# Altium project FlightBoard.PrjPcb
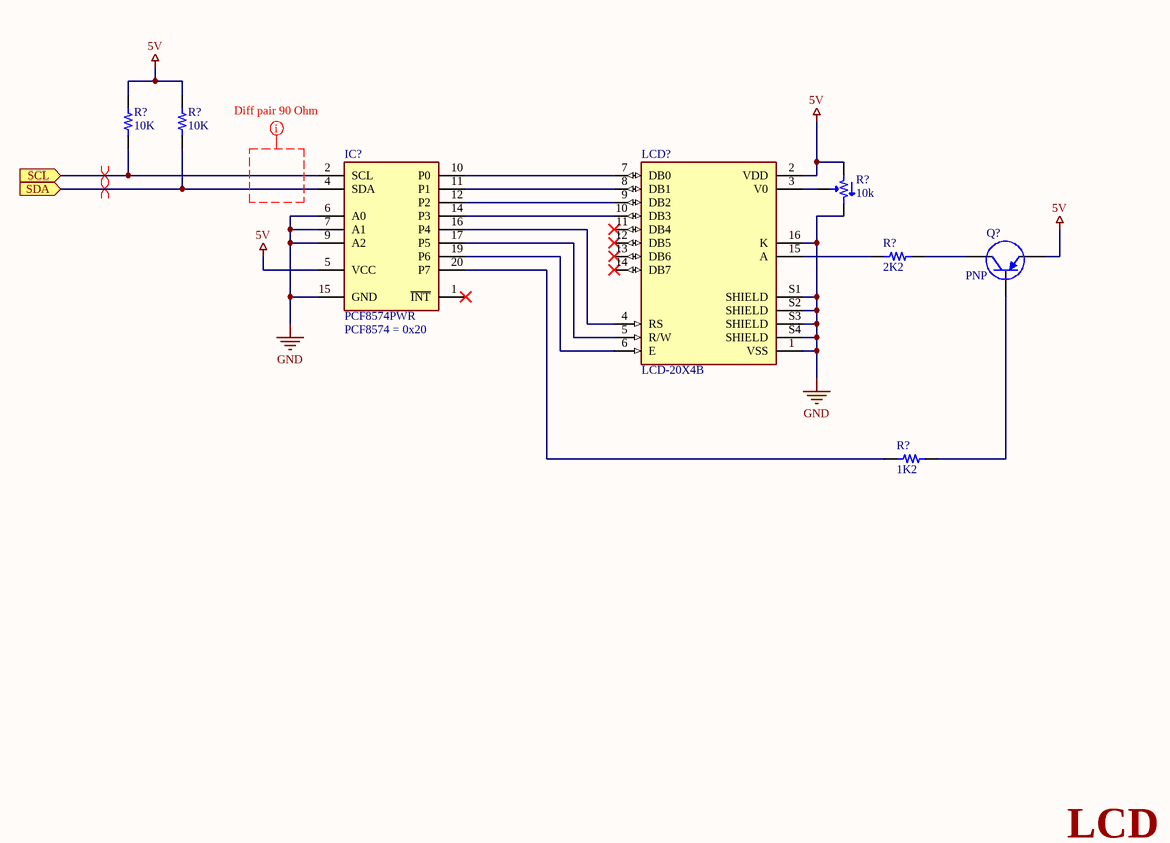
[diagram p0: LCD.SchDoc]
4 sheets, 50 parts. Net scope: flat (ports and power ports of the same name join across sheets).
Board files: PCB_FlightBoard.PcbDoc, Test.PcbDoc
Sheets:
  LCD.SchDoc
  Power.SchDoc
  CPU.SchDoc
  Sensors.SchDoc

## Sheet LCD.SchDoc
size A4; SheetNumber: 1; SheetTotal: 4

### Parts
(Parts that share a designator on the sheet are numbered #1, #2 ... from top to bottom, then left to right.)
IC?  PCF8574PWR  [SOP65P640X120-20N]
LCD?  LCD-20X4B  [LCD_LCD-20X4B]
Q?  PNP  [SOT-23B_N]
R?#1  10K  [RES 0603/1608]
R?#2  10K  [RES 0603/1608]
R?#3  10k  [POT BOURNS TRIMPOT 3302]
R?#4  2K2  [RES 0603/1608]
R?#5  1K2  [RES 0603/1608]

### Ports
SCL (in), SDA (in)

### Nets
5V: IC?.5(VCC) LCD?.2(VDD) Q?.3(E) R?#1.2 R?#2.2 R?#3.1
GND: IC?.6(A0) IC?.7(A1) IC?.9(A2) IC?.15(GND) LCD?.1(VSS) LCD?.16(K) LCD?.S1(SHIELD) LCD?.S2(SHIELD) LCD?.S3(SHIELD) LCD?.S4(SHIELD) R?#3.3
NetIC?_2: IC?.2(SCL) R?#1.1 ; port SCL
NetIC?_4: IC?.4(SDA) R?#2.1 ; port SDA
NetIC?_10: IC?.10(P0) LCD?.7(DB0)
NetIC?_11: IC?.11(P1) LCD?.8(DB1)
NetIC?_12: IC?.12(P2) LCD?.9(DB2)
NetIC?_14: IC?.14(P3) LCD?.10(DB3)
NetIC?_16: IC?.16(P4) LCD?.4(RS)
NetIC?_17: IC?.17(P5) LCD?.5(R/W)
NetIC?_19: IC?.19(P6) LCD?.6(E)
NetIC?_20: IC?.20(P7) R?#5.1
NetLCD?_3: LCD?.3(V0) R?#3.2
NetLCD?_15: LCD?.15(A) R?#4.1
NetQ?_1: Q?.1(C) R?#4.2
NetQ?_2: Q?.2(B) R?#5.2

Not connected (* = marked no-connect by the designer): IC? 1(~{INT})*; LCD? 11(DB4)* 12(DB5)* 13(DB6)* 14(DB7)*

### Layout directives
differential pair: NetIC?_2, NetIC?_4
mark named Diff pair 90 Ohm: (no net found under the mark)

### Notes on the sheet
- (near IC?) PCF8574 = 0x20
- LCD

### Library data of the parts
IC? = PCF8574PWR: Integrated Circuit; Manufacturer_Name: Texas Instruments; Datasheet Link: http://www.ti.com/lit/ds/symlink/pcf8574.pdf; Height: 1.2mm; Manufacturer_Part_Number: PCF8574PWR; Mouser Part Number: 595-PCF8574PWR; Mouser Price/Stock: https://www.mouser.co.uk/ProductDetail/Texas-Instruments/PCF8574PWR?qs=X1HXWTtiZ0T3gnyuO%2Fq4CA%3D%3D; Arrow Part Number: PCF8574PWR; Arrow Price/Stock: https://www.arrow.com/en/products/pcf8574pwr/texas-instruments?region=nac
LCD? = LCD-20X4B: Display Development Tools 20X4 CHARACTER BLUE LCD W/BACKLIGHT; Value: *; Availability: Unavailable; Price: None; Package: None; MP: LCD-20X4B
Q? = BC327-25: PNP Bipolar Transistor; Published: 8-Jun-2000; LatestRevisionDate: 29-May-2009; LatestRevisionNote: IPC-7351 Footprint Added.; PackageVersion: Aug-1999; PackageReference: SOT-23B; Publisher: Altium Limited; PackageDescription: 3-Pin SOT-23 Package 0.95 mm Pitch, 2.4 mm Lead Span
R?#1 R?#2 = 0603S8J0103: RES SMD 10K OHM 5% 1/8W 0603; Manufacturer: Uniohm; TemperatureRange: -55C ~ 155C; TemperatureCoefficient: 100ppm/C; PowerRating: 0.125W, 1/8W; Value: 10K; Part Number: 0603S8J0103; Tolerance: 5%; Price: 0.0089; Device Package: 1608 (0603 Metric)
R?#3 = 3302W-3-103E: TRIMMER 10K OHM 0.15W SMD; Manufacturer: Bourns Inc.; TemperatureCoefficient: 250ppm/C; Tolerance: 25%; Number Of Turns: 1; Adjustment Type: Top Adjustment; Value: 10k; Part Number: 3302W-3-103E; PartId: 29445; Supplier 1: Digi-Key; Supplier Part Number 1: 3302W-103ECT-ND; ComponentLink1Description: Datasheet; ComponentLink1URL: http://www.bourns.com/docs/Product-Datasheets/3302.pdf; ComponentLink2Description: Digi-Key Listing; ComponentLink2URL: https://www.digikey.com/product-detail/en/bourns-inc/3302W-3-103E/3302W-103ECT-ND/612876; PowerRating: 0.15W; Price: 0.97
R?#4 = 0603S8J0222: RES SMD 2K2 OHM 5% 1/8W 0603; Manufacturer: Uniohm; TemperatureRange: -55C ~ 155C; TemperatureCoefficient: 100ppm/C; PowerRating: 0.125W, 1/8W; Value: 2K2; Part Number: 0603S8J0222; Tolerance: 5%; Price: 0.0089; Device Package: 1608 (0603 Metric)
R?#5 = 0603S8J0122: RES SMD 1K2 OHM 5% 1/8W 0603; Manufacturer: Uniohm; TemperatureRange: -55C ~ 155C; TemperatureCoefficient: 100ppm/C; PowerRating: 0.125W, 1/8W; Value: 1K2; Part Number: 0603S8J0122; Tolerance: 5%; Price: 0.0089; Device Package: 1608 (0603 Metric)

## Sheet Power.SchDoc
size A4; SheetNumber: 4; SheetTotal: 4
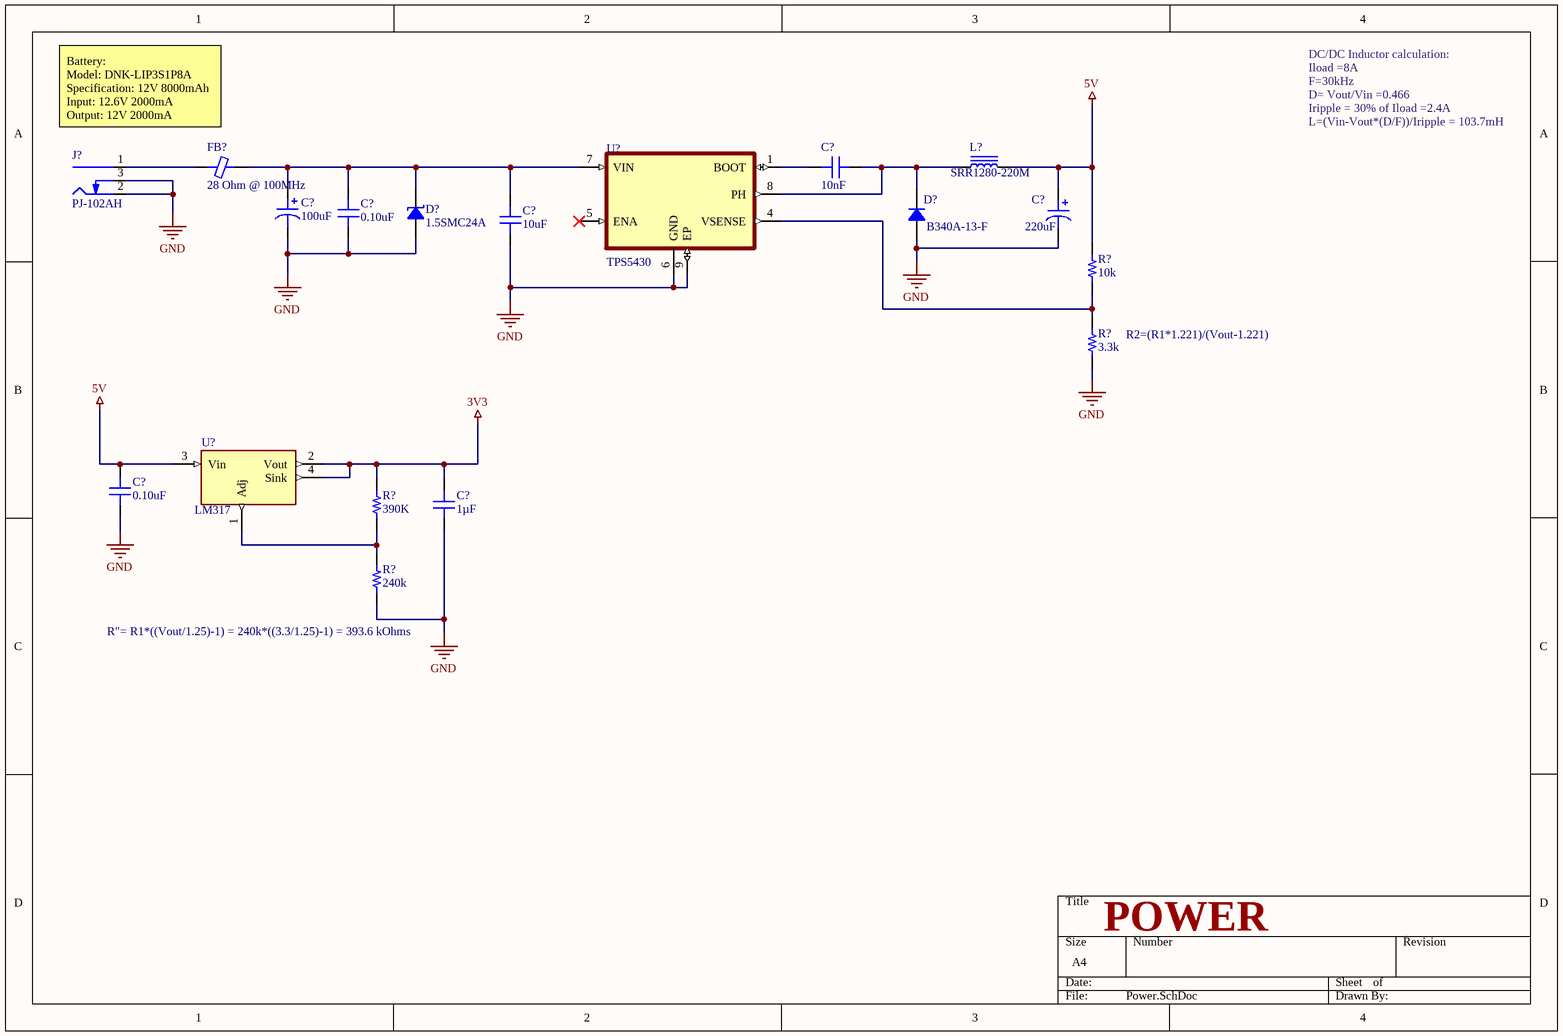
[diagram p1: Power.SchDoc]

### Parts
(Parts that share a designator on the sheet are numbered #1, #2 ... from top to bottom, then left to right.)
C?#1  10nF  [CAP 0805/2012]
C?#2  100uF  [CAP ALUM 10.3MM]
C?#3  0.10uF  [CAP 0603/1608]
C?#4  220uF  [CAP ALUM 10.3MM]
C?#5  10uF  [CAP 1210/3225 - 2.8MM]
C?#6  0.10uF  [CAP 0603/1608]
C?#7  1µF  [CAP 0805_2012]
D?#1  1.5SMC24A  [DO214AB SMC]
D?#2  B340A-13-F  [DO214AC SMA]
FB?#1  28 Ohm @ 100MHz  [FER 0603/1608]
J?  PJ-102AH  [CUI PJ-102AH]
L?  SRR1280-220M  [BOURNS SRR1280]
R?#6  10k  [RES 0603/1608]
R?#7  3.3k  [RES 0603/1608]
R?#8  390K  [RES 0603/1608]
R?#9  240k  [RES 0603/1608]
U?#1  TPS5430  [VREG_LM5017MR/NOPB]
U?#2  LM317  [TI SOT-223 DCY]

### Nets
3V3: C?#7.2 R?#8.2 U?#2.2(Vout) U?#2.4(Sink)
5V: C?#4.1 C?#6.2 L?.2 R?#6.2 U?#2.3(Vin)
GND: C?#2.2 C?#3.1 C?#4.2 C?#5.2 C?#6.1 C?#7.1 D?#1.1 D?#2.1 J?.2(Outer) J?.3(SW) R?#7.1 R?#9.1 U?#1.6(GND) U?#1.9(EP)
NetC?#1_1: C?#1.1 U?#1.1(BOOT)
NetC?#1_2: C?#1.2 D?#2.2 L?.1 U?#1.8(PH)
NetC?#2_1: C?#2.1 C?#3.2 C?#5.1 D?#1.2 FB?#1.2 U?#1.7(VIN)
NetFB?#1_1: FB?#1.1 J?.1(Centre)
NetR?#6_1: R?#6.1 R?#7.2 U?#1.4(VSENSE)
NetR?#8_1: R?#8.1 R?#9.2 U?#2.1(Adj)

Not connected (* = marked no-connect by the designer): U?#1 5(ENA)*

### Notes on the sheet
- Battery:
  Model: DNK-LIP3S1P8A
  Specification: 12V 8000mAh
  Input: 12.6V 2000mA
  Output: 12V 2000mA
- DC/DC Inductor calculation:
  Iload =8A
  F=30kHz
  D= Vout/Vin =0.466
  Iripple = 30% of Iload =2.4A
  L=(Vin-Vout*(D/F))/Iripple = 103.7mH
- (near R?#7) R2=(R1*1.221)/(Vout-1.221)
- (near R?#9) R"= R1*((Vout/1.25)-1) = 240k*((3.3/1.25)-1) = 393.6 kOhms
- POWER

### Library data of the parts
C?#1 = C0805C103K5RACAUTO: CAP CER 10000PF 50V X7R 0805; Manufacturer: Kemet; TemperatureRange: -55C ~ 125C; Tolerance: 10%; Value: 10nF; Part Number: C0805C103K5RACAUTO; PartId: 14086; Supplier 1: Digi-Key; Supplier Part Number 1: 399-6924-2-ND; ComponentLink1Description: Datasheet; ComponentLink1URL: http://www.kemet.com/docfinder?Partnumber=C0805C103K5RACAUTO; ComponentLink2Description: Digi-Key Listing; ComponentLink2URL: https://www.digikey.com/product-detail/en/kemet/C0805C103K5RACAUTO/399-6924-2-ND/3314918; TemperatureCoefficient: X7R; Voltage: 50V; Price: 0.0167; Device Package: 0805 (2012 Metric)
C?#2 = EEE-1HA101P: CAP ALUM 100UF 20% 50V SMD; Manufacturer: Panasonic Electronic Components; TemperatureRange: -40C ~ 85C; Type: Automotive; Ripple Current: 250mA; Lifetime @ Temp: 2000 Hrs @ 85C; Value: 100uF; Part Number: EEE-1HA101P; PartId: 7398; Supplier 1: Digi-Key; Supplier Part Number 1: PCE3916TR-ND; ComponentLink1Description: Datasheet; ComponentLink1URL: http://media.digikey.com/pdf/Data%20Sheets/Panasonic%20Electronic%20Components/S_Series_Type_V.pdf; ComponentLink2Description: Digi-Key listing; ComponentLink2URL: http://digikey.com/product-detail/en/EEE-1HA101P/PCE3916TR-ND/766083; Tolerance: 20%; Voltage: 50V; Price: 0.3144; Device Package: Radial, Can - SMD; Impedance: -
C?#3 C?#6 = C0603C104J3RACTU: CAP CER 0.1UF 25V X7R 0603; Manufacturer: Kemet; TemperatureRange: -55C ~ 125C; Tolerance: 5%; Value: 0.10uF; Part Number: C0603C104J3RACTU; PartId: 13224; Supplier 1: Digi-Key; Supplier Part Number 1: 399-1282-2-ND; ComponentLink1Description: Datasheet; ComponentLink1URL: http://www.kemet.com/docfinder?Partnumber=C0603C104J3RACTU; ComponentLink2Description: Digi-Key Listing; ComponentLink2URL: https://www.digikey.com/product-detail/en/kemet/C0603C104J3RACTU/399-1282-2-ND/416045; TemperatureCoefficient: X7R; Voltage: 25V; Price: 0.0714; Device Package: 0603 (1608 Metric)
C?#4 = 875075561008: CAP POLYMER 220UF 20% 25V SMD; Manufacturer: Wurth Electronics Inc; TemperatureRange: -55C ~ 105C; Type: General Purpose; Ripple Current: 4.8A; Lifetime @ Temp: 2000 Hrs @ 105C; Value: 220uF; Part Number: 875075561008; PartId: 7727; Supplier 1: Digi-Key; Supplier Part Number 1: 732-6502-2-ND; ComponentLink1Description: Datasheet; ComponentLink1URL: http://katalog.we-online.de/pbs/datasheet/875075561008.pdf; ComponentLink2Description: Digi-Key listing; ComponentLink2URL: http://digikey.com/product-detail/en/875075561008/732-6502-2-ND/5147666; Tolerance: 20%; Voltage: 25V; Price: 1.8044; Device Package: Radial, Can - SMD; Impedance: -
C?#5 = 12105C106KAT2A: CAP CER 10UF 50V X7R 1210; Manufacturer: AVX Corporation; TemperatureRange: -55C ~ 125C; Tolerance: 10%; Value: 10uF; Part Number: 12105C106KAT2A; PartId: 19201; Supplier 1: Digi-Key; Supplier Part Number 1: 478-9912-2-ND; ComponentLink1Description: Datasheet; ComponentLink1URL: http://datasheets.avx.com/X7RDielectric.pdf; ComponentLink2Description: Digi-Key Listing; ComponentLink2URL: https://www.digikey.com/product-detail/en/avx-corporation/12105C106KAT2A/478-9912-2-ND/6006191; TemperatureCoefficient: X7R; Voltage: 50V; Price: 0.2813; Device Package: 1210 (3225 Metric)
C?#7 = CL21A105KBCLNNC: CAP CER 1UF 50V X5R 0805; Manufacturer: Samsung Electro-Mechanics; Tolerance: ±10%; Part Number: CL21A105KBCLNNC; Value: 1µF; Applications: General Purpose; Capacitance: 1µF; ComponentLink1Description: Datasheet; ComponentLink1URL: http://www.samsungsem.com/kr/support/product-search/mlcc/CL21A105KBCLNNC.jsp; ComponentLink2Description: DigiKey Link; ComponentLink2URL: http://digikey.com/product-detail/en/samsung-electro-mechanics/CL21A105KBCLNNC/1276-2396-1-ND/3890482; Device Package: 0805 (2012 Metric); Features: Low Profile; LastUpdated: 9/2/2020 1:04:16 AM; Lifecycle Status: Active; Minimum Order: 1; Mounting Type: Surface Mount, MLCC; Operating Temperature: -55°C ~ 85°C; Package / Case: 0805 (2012 Metric); Packaging: TapeAndReel; PartId: 15373; Part Status: Active; Price: 0.03; Series: CL; Size / Dimension: 0.079" L x 0.049" W (2.00mm x 1.25mm); Supplier 1: DigiKey; Supplier Part Number 1: 1276-2396-1-ND; Temperature Coefficient: X5R; Thickness (Max): 0.037" (0.95mm); Voltage - Rated: 50V
D?#1 = 1.5SMC24A: TVS DIODE 20.5V 33.2V DO214AB; Manufacturer: Littelfuse Inc.; Current - Peak Pulse (10/1000µs): 45.8A; Power Line Protection: No; Power - Peak Pulse: 1500W (1.5kW); Type: Zener; Unidirectional Channels: 1; Voltage - Breakdown (Min): 22.8V; Part Number: 1.5SMC24A; Applications: General Purpose; ComponentLink1Description: Datasheet; ComponentLink1URL: https://www.littelfuse.com/~/media/electronics/datasheets/tvs_diodes/littelfuse_tvs_diode_1_5smc_datasheet.pdf.pdf; ComponentLink2Description: DigiKey Link; ComponentLink2URL: http://digikey.com/product-detail/en/littelfuse-inc/1.5SMC24A/1.5SMC24ACT-ND/1835386; LastUpdated: 9/2/2020 1:20:00 AM; Lifecycle Status: Active; Minimum Order: 1; Mounting Type: Surface Mount; Operating Temperature: -55°C ~ 150°C (TJ); Package / Case: DO-214AB, SMC; Packaging: TapeAndReel; PartId: 6399; Part Status: Active; Price: 0.18; Series: 1.5SMC; Supplier 1: DigiKey; Supplier Part Number 1: 1.5SMC24ACT-ND; Supplier Device Package: DO-214AB (SMCJ); Voltage - Clamping (Max) @ Ipp: 33.2V; Voltage - Reverse Standoff (Typ): 20.5V
D?#2 = B340A-13-F: DIODE SCHOTTKY 40V 3A SMA; Manufacturer: Diodes Incorporated; Current Reverse Leakage @ Vr: 500uA @ 40V; Voltage Forward (Vf): 500mV @ 3A; Part Number: B340A-13-F; PartId: 16333; Supplier 1: Digi-Key; Supplier Part Number 1: B340A-FDITR-ND; ComponentLink1Description: Datasheet; ComponentLink1URL: http://www.diodes.com/_files/datasheets/ds30891.pdf; ComponentLink2Description: Digi-Key Listing; ComponentLink2URL: https://www.digikey.com/product-detail/en/diodes-incorporated/B340A-13-F/B340A-FDITR-ND/725015; Junction Operating Temperature: -55C ~ 150C; Price: 0.1085; Type: Schottky; Device Package: DO-214AC, SMA; Voltage DC Reverse (Vr): 40V; Current Rectified: 3A
FB?#1 = 742792603: FERRITE CHIP 28 OHM 4.0A 0603; Manufacturer: Wurth Electronics Inc; Type: Differential Mode - Single; DC Resistance: 30 mOhm Max; Current Rating: 4A; Part Number: 742792603; PartId: 6745; Value: 28 Ohm @ 100MHz; Supplier 1: Digi-Key; Supplier Part Number 1: 732-1590-2-ND; ComponentLink1Description: Datasheet; ComponentLink1URL: http://katalog.we-online.de/pbs/datasheet/742792603.pdf; ComponentLink2Description: Digi-Key listing; ComponentLink2URL: http://digikey.com/product-detail/en/742792603/732-1590-2-ND/1638994; Price: 0.1829; Device Package: 0603 (1608 Metric)
J? = PJ-102AH: CONN PWR JACK 2X5.5MM SOLDER; Manufacturer: CUI Devices; Actual Diameter: 0.079" (2.00mm ID), 0.256" (6.50mm OD); Current Rating (Amps): 5A; Gender: Male; Industry Recognized Mating Diameter: 2.00mm ID (0.079"), 5.50mm OD (0.217"); Internal Switch(s): Single Switch, Normally Closed; Material Flammability Rating: UL94 V-0; Mating Length/Depth: 0.354" (9.00mm); Number of Positions/Contacts: 2 Conductors, 3 Contacts; Shielding: Unshielded; Voltage - Rated: 24VDC; Part Number: PJ-102AH; ComponentLink1Description: Datasheet; ComponentLink1URL: https://www.cuidevices.com/product/resource/digikeypdf/pj-102ah.pdf; ComponentLink2Description: DigiKey Link; ComponentLink2URL: //digikey.com/product-detail/en/cui-devices/PJ-102AH/CP-102AH-ND/408448; Connector Type: Jack; LastUpdated: 12/16/2019 7:01:27 PM; Lifecycle Status: 0; Minimum Order: 1; Mounting Type: Through Hole, Right Angle; Packaging: Tray; Part Status: Active; Price: 0.76; Series: -; Supplier 1: DigiKey; Supplier Part Number 1: CP-102AH-ND; Termination: Solder
L? = SRR1280-220M: FIXED IND 22UH 4.3A 38.6 MOHM; Manufacturer: Bourns Inc.; Type: Wirewound; Material - Core: Ferrite; Tolerance: 20%; Current - Saturation: 4.1A; Shielding: Shielded; DC Resistance (DCR): 38.6 mOhm Max; Q @ Freq: 20 @ 2.52MHz; Frequency - Self Resonant: 11MHz; Value: 22uH; Part Number: SRR1280-220M; PartId: 15714; Supplier 1: Digi-Key; Supplier Part Number 1: SRR1280-220MTR-ND; ComponentLink1Description: Datasheet; ComponentLink1URL: http://www.bourns.com/docs/Product-Datasheets/SRR1280.pdf; ComponentLink2Description: Digi-Key Listing; ComponentLink2URL: https://www.digikey.com/product-detail/en/bourns-inc/SRR1280-220M/SRR1280-220MTR-ND/1969996; Price: 0.7737; Device Package: Nonstandard; Series: SRR1280; Inductance: 22uH; Current Rating: 4.3A; Operating Temperature: -40C ~ 125C
R?#6 = ERA-3AEB103V: RES SMD 10K OHM 0.1% 1/10W 0603; Manufacturer: Panasonic Electronic Components; TemperatureRange: -55C ~ 155C; TemperatureCoefficient: 25ppm/C; PowerRating: 0.1W, 1/10W; Value: 10k; Part Number: ERA-3AEB103V; PartId: 1432; Supplier 1: Digi-Key; Supplier Part Number 1: P10KDBTR-ND; ComponentLink1Description: Datasheet; ComponentLink1URL: http://industrial.panasonic.com/lecs/www-data/pdf/AOA0000/AOA0000CE26.pdf; ComponentLink2Description: Digi-Key listing; ComponentLink2URL: http://digikey.com/product-detail/en/ERA-3AEB103V/P10KDBTR-ND/1465878; Tolerance: 0.1%; Price: 0.055; Type: Thin Film; Device Package: 0603 (1608 Metric)
R?#7 = ERA-3APB332V: RES SMD 3.3K OHM 0.1% 1/10W 0603; Manufacturer: Panasonic Electronic Components; TemperatureRange: -55C ~ 155C; TemperatureCoefficient: 15ppm/C; PowerRating: 0.1W, 1/10W; Value: 3.3k; Part Number: ERA-3APB332V; PartId: 1857; Supplier 1: Digi-Key; Supplier Part Number 1: P3.3KAYTR-ND; ComponentLink1Description: Datasheet; ComponentLink1URL: http://industrial.panasonic.com/lecs/www-data/pdf/AOA0000/AOA0000CE26.pdf; ComponentLink2Description: Digi-Key listing; ComponentLink2URL: http://digikey.com/product-detail/en/ERA-3APB332V/P3.3KAYTR-ND/3070646; Tolerance: 0.1%; Price: 0.2873; Type: Thin Film; Device Package: 0603 (1608 Metric)
R?#8 = 0603S8J0394: RES SMD 390K OHM 5% 1/8W 0603; Manufacturer: Uniohm; TemperatureRange: -55C ~ 155C; TemperatureCoefficient: 100ppm/C; PowerRating: 0.125W, 1/8W; Value: 390K; Part Number: 0603S8J0394; Tolerance: 5%; Price: 0.0089; Device Package: 1608 (0603 Metric)
R?#9 = ERJ-3EKF2403V: RES SMD 240K OHM 1% 1/10W 0603; Manufacturer: Panasonic Electronic Components; TemperatureRange: -55C ~ 155C; TemperatureCoefficient: 100ppm/C; PowerRating: 0.1W, 1/10W; Value: 240k; Part Number: ERJ-3EKF2403V; PartId: 1186; Supplier 1: Digi-Key; Supplier Part Number 1: P240KHTR-ND; ComponentLink1Description: Datasheet; ComponentLink1URL: http://industrial.panasonic.com/www-cgi/jvcr13pz.cgi?E+PZ+3+AOA0002+ERJ3EKF2403V+7+WW; ComponentLink2Description: Digi-Key listing; ComponentLink2URL: http://digikey.com/product-detail/en/ERJ-3EKF2403V/P240KHTR-ND/1746349; Tolerance: 1%; Price: 0.0038; Type: Thick Film; Device Package: 0603 (1608 Metric)
U?#1 = TPS5430DDA: CONVERTER 5.5V-36 to 5.5V; MF: Texas Instruments; Availability: Unavailable; Mouser-Purchase-URL: https://snapeda.com/shop?store=Mouser&id=226174; Texas_Instruments-Purchase-URL: https://snapeda.com/shop?store=Texas+Instruments&id=226174; Package: HSOIC-8 Texas Instruments; Price: None; SnapEDA_Link: https://www.snapeda.com/parts/TPS5430DDA/Texas%20Instruments/view-part/226174/?ref=snap; MP: TPS5430DDA; DigiKey-Purchase-URL: https://snapeda.com/shop?store=DigiKey&id=226174; Value: *
U?#2 = LM317DCVR: Adjustable voltage regulator, 1.5A, output range 1.25 - 37 V

## Sheet CPU.SchDoc
size A4; SheetNumber: 2; SheetTotal: 4
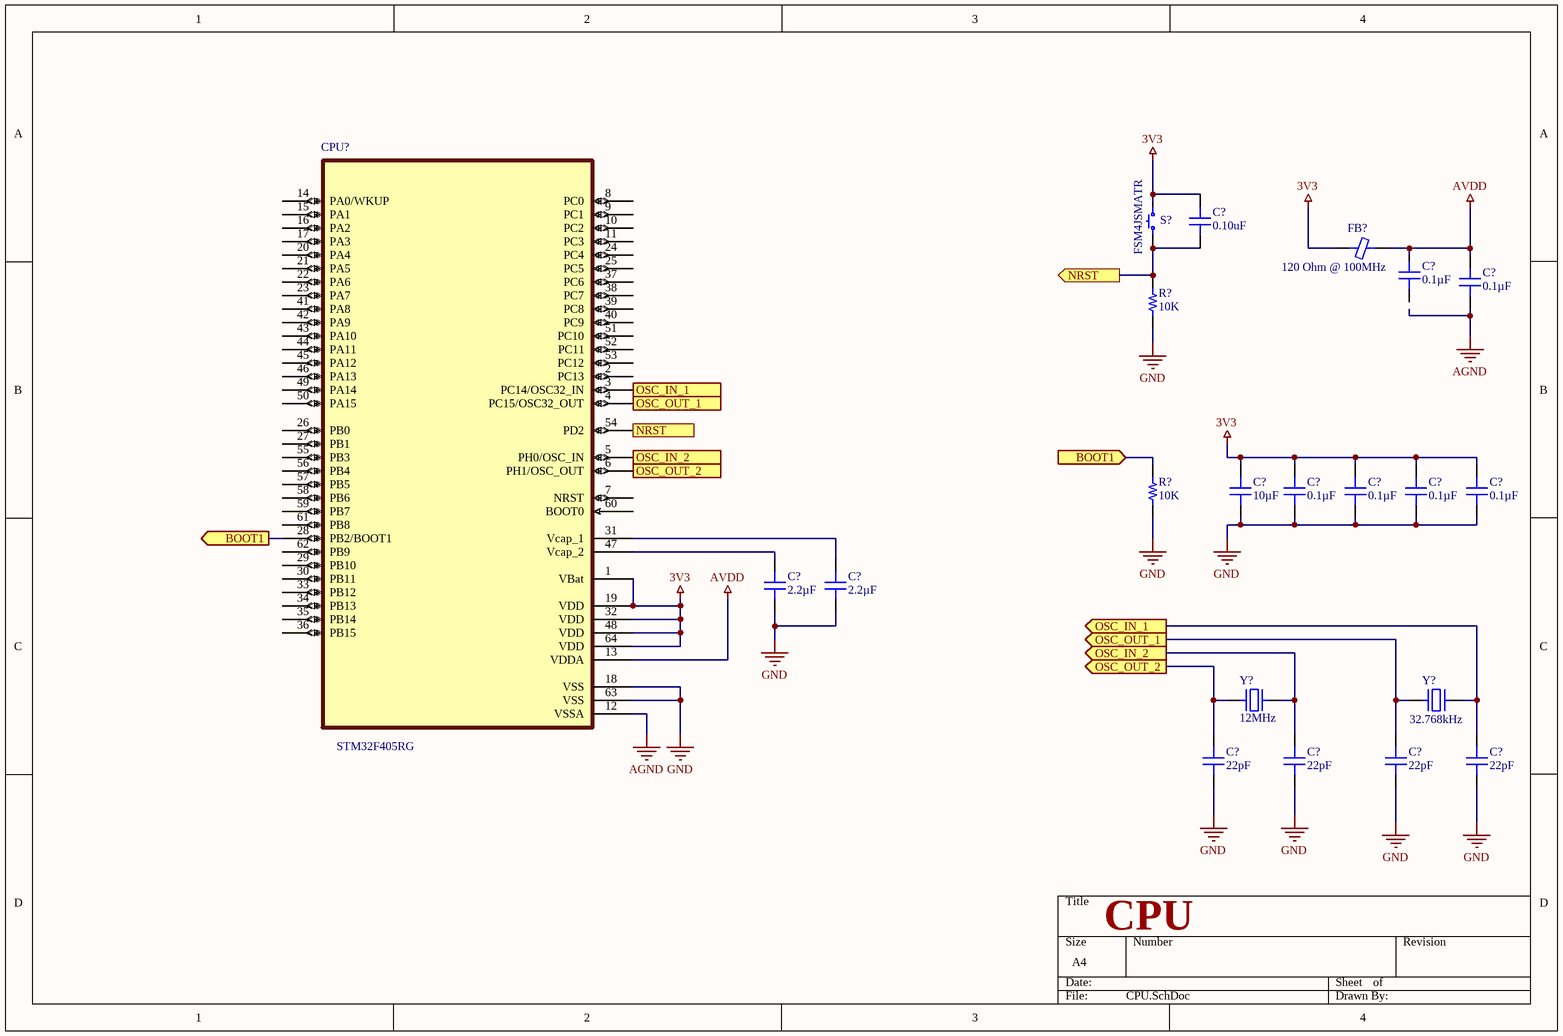
[diagram p2: CPU.SchDoc]

### Parts
(Parts that share a designator on the sheet are numbered #1, #2 ... from top to bottom, then left to right.)
C?#8  0.10uF  [CAP 0603/1608]
C?#9  0.1µF  [CAP 0603_1608]
C?#10  0.1µF  [CAP 0603_1608]
C?#11  10µF  [CAP 0603_1608]
C?#12  0.1µF  [CAP 0603_1608]
C?#13  0.1µF  [CAP 0603_1608]
C?#14  0.1µF  [CAP 0603_1608]
C?#15  0.1µF  [CAP 0603_1608]
C?#16  2.2µF  [CAP 0603_1608]
C?#17  2.2µF  [CAP 0603_1608]
C?#18  22pF  [CAP 0402_1005]
C?#19  22pF  [CAP 0402_1005]
C?#20  22pF  [CAP 0402_1005]
C?#21  22pF  [CAP 0402_1005]
CPU?  STM32F405RG  [LQF64]
FB?#2  120 Ohm @ 100MHz  [FER 0805/2012]
R?#10  10K  [RES 0603/1608]
R?#11  10K  [RES 0603/1608]
S?  FSM4JSMATR  [TE FSM4JSMA]
Y?#1  12MHz  [ECS CSM-3X]
Y?#2  32.768kHz  [ABRACON ABS25]

### Ports
BOOT1 (in), BOOT1 (out), NRST (out), OSC_IN_1 (out), OSC_IN_2 (out), OSC_OUT_1 (out), OSC_OUT_2 (out)

### Nets
3V3: C?#8.2 C?#11.2 C?#12.2 C?#13.2 C?#14.2 C?#15.2 CPU?.1(VBat) CPU?.19(VDD) CPU?.32(VDD) CPU?.48(VDD) CPU?.64(VDD) FB?#2.1 S?.1 S?.2
AGND: C?#10.1 CPU?.12(VSSA)
AVDD: C?#9.2 C?#10.2 CPU?.13(VDDA) FB?#2.2
GND: C?#11.1 C?#12.1 C?#13.1 C?#14.1 C?#15.1 C?#16.1 C?#17.1 C?#18.1 C?#19.2 C?#20.1 C?#21.1 CPU?.18(VSS) CPU?.63(VSS) R?#10.1 R?#11.1
NetC?#8_1: C?#8.1 CPU?.54(PD2) R?#10.2 S?.3 S?.4 ; port NRST
NetC?#16_2: C?#16.2 CPU?.47(Vcap_2)
NetC?#17_2: C?#17.2 CPU?.31(Vcap_1)
NetC?#18_2: C?#18.2 CPU?.6(PH1/OSC_OUT) Y?#1.1 ; port OSC_OUT_2
NetC?#19_1: C?#19.1 CPU?.5(PH0/OSC_IN) Y?#1.2 ; port OSC_IN_2
NetC?#20_2: C?#20.2 CPU?.4(PC15/OSC32_OUT) Y?#2.1 ; port OSC_OUT_1
NetC?#21_2: C?#21.2 CPU?.3(PC14/OSC32_IN) Y?#2.4 ; port OSC_IN_1
NetCPU?_28: CPU?.28(PB2/BOOT1) R?#11.2 ; port BOOT1

Not connected (* = marked no-connect by the designer): C?#9 1; CPU? 2(PC13) 7(NRST) 8(PC0) 9(PC1) 10(PC2) 11(PC3) 14(PA0/WKUP) 15(PA1) 16(PA2) 17(PA3) 20(PA4) 21(PA5) 22(PA6) 23(PA7) 24(PC4) 25(PC5) 26(PB0) 27(PB1) 29(PB10) 30(PB11) 33(PB12) 34(PB13) 35(PB14) 36(PB15) 37(PC6) 38(PC7) 39(PC8) 40(PC9) 41(PA8) 42(PA9) 43(PA10) 44(PA11) 45(PA12) 46(PA13) 49(PA14) 50(PA15) 51(PC10) 52(PC11) 53(PC12) 55(PB3) 56(PB4) 57(PB5) 58(PB6) 59(PB7) 60(BOOT0) 61(PB8) 62(PB9)

### Notes on the sheet
- CPU

### Library data of the parts
C?#8 = CL10B104KB8NNNC: CAP CER 0.1UF 50V X7R 0603; Manufacturer: Samsung Electro-Mechanics America, Inc.; TemperatureRange: -55C ~ 125C; Tolerance: 10%; Value: 0.10uF; Part Number: CL10B104KB8NNNC; PartId: 12945; Supplier 1: Digi-Key; Supplier Part Number 1: 1276-1000-2-ND; ComponentLink1Description: Datasheet; ComponentLink1URL: http://www.samsungsem.com/kr/support/product-search/mlcc/CL10B104KB8NNNC.jsp; ComponentLink2Description: Digi-Key Listing; ComponentLink2URL: https://www.digikey.com/product-detail/en/samsung-electro-mechanics-america-inc/CL10B104KB8NNNC/1276-1000-2-ND/3886658; TemperatureCoefficient: X7R; Voltage: 50V; Price: 0.0052; Device Package: 0603 (1608 Metric)
C?#9 C?#10 C?#12-C?#15 = 06033C104JAT2A: CAP CER 0.1UF 25V X7R 0603; Manufacturer: AVX Corporation; Tolerance: ±5%; Part Number: 06033C104JAT2A; Value: 0.1µF; Applications: General Purpose; Capacitance: 0.1µF; ComponentLink1Description: Datasheet; ComponentLink1URL: http://datasheets.avx.com/X7RDielectric.pdf; ComponentLink2Description: DigiKey Link; ComponentLink2URL: http://digikey.com/product-detail/en/avx-corporation/06033C104JAT2A/478-3713-1-ND/1116411; Device Package: 0603 (1608 Metric); LastUpdated: 9/2/2020 1:03:17 AM; Lifecycle Status: Active; Minimum Order: 1; Mounting Type: Surface Mount, MLCC; Operating Temperature: -55°C ~ 125°C; Package / Case: 0603 (1608 Metric); Packaging: TapeAndReel; PartId: 12698; Part Status: Active; Price: 0.07; Series: -; Size / Dimension: 0.063" L x 0.032" W (1.60mm x 0.81mm); Supplier 1: DigiKey; Supplier Part Number 1: 478-3713-1-ND; Temperature Coefficient: X7R; Thickness (Max): 0.035" (0.90mm); Voltage - Rated: 25V
C?#11 = CL10A106MA8NRNC: CAP CER 10UF 25V X5R 0603; Manufacturer: Samsung Electro-Mechanics; Tolerance: ±20%; Part Number: CL10A106MA8NRNC; Value: 10µF; Applications: General Purpose; Capacitance: 10µF; ComponentLink1Description: Datasheet; ComponentLink1URL: http://www.samsungsem.com/kr/support/product-search/mlcc/CL10A106MA8NRNC.jsp; ComponentLink2Description: DigiKey Link; ComponentLink2URL: http://digikey.com/product-detail/en/samsung-electro-mechanics/CL10A106MA8NRNC/1276-1869-1-ND/3889955; Device Package: 0603 (1608 Metric); LastUpdated: 9/2/2020 1:03:19 AM; Lifecycle Status: Active; Minimum Order: 1; Mounting Type: Surface Mount, MLCC; Operating Temperature: -55°C ~ 85°C; Package / Case: 0603 (1608 Metric); Packaging: TapeAndReel; PartId: 11461; Part Status: Active; Price: 0.18; Series: CL; Size / Dimension: 0.063" L x 0.031" W (1.60mm x 0.80mm); Supplier 1: DigiKey; Supplier Part Number 1: 1276-1869-1-ND; Temperature Coefficient: X5R; Thickness (Max): 0.035" (0.90mm); Voltage - Rated: 25V
C?#16 C?#17 = C1608JB1E225K080AB: CAP CER 2.2UF 25V JB 0603; Manufacturer: TDK Corporation; Tolerance: ±10%; Part Number: C1608JB1E225K080AB; Value: 2.2µF; Applications: General Purpose; Capacitance: 2.2µF; ComponentLink1Description: Datasheet; ComponentLink1URL: https://product.tdk.com/info/en/catalog/datasheets/mlcc_commercial_general_en.pdf?ref_disty=digikey; ComponentLink2Description: DigiKey Link; ComponentLink2URL: http://digikey.com/product-detail/en/tdk-corporation/C1608JB1E225K080AB/445-11245-1-ND/3952911; Device Package: 0603 (1608 Metric); Features: Low ESL; LastUpdated: 9/2/2020 1:03:22 AM; Lifecycle Status: Active; Minimum Order: 1; Mounting Type: Surface Mount, MLCC; Operating Temperature: -25°C ~ 85°C; Package / Case: 0603 (1608 Metric); Packaging: TapeAndReel; PartId: 10303; Part Status: Active; Price: 0.05; Series: C; Size / Dimension: 0.063" L x 0.031" W (1.60mm x 0.80mm); Supplier 1: DigiKey; Supplier Part Number 1: 445-11245-1-ND; Temperature Coefficient: JB; Thickness (Max): 0.035" (0.90mm); Voltage - Rated: 25V
C?#18-C?#21 = 04023A220KAT2A: CAP CER 22PF 25V NP0 0402; Manufacturer: AVX Corporation; Temperature Coefficient: C0G, NP0; Tolerance: ±10%; Part Number: 04023A220KAT2A; Value: 22pF; Applications: General Purpose; Capacitance: 22pF; ComponentLink1Description: Datasheet; ComponentLink1URL: http://datasheets.avx.com/C0GNP0-Dielectric.pdf; ComponentLink2Description: DigiKey Link; ComponentLink2URL: http://digikey.com/product-detail/en/avx-corporation/04023A220KAT2A/478-12611-1-ND/9949149; Device Package: 0402 (1005 Metric); LastUpdated: 9/2/2020 1:02:24 AM; Lifecycle Status: Active; Minimum Order: 1; Mounting Type: Surface Mount, MLCC; Operating Temperature: -55°C ~ 125°C; Package / Case: 0402 (1005 Metric); Packaging: TapeAndReel; PartId: 1976; Part Status: Active; Price: 0.01; Series: -; Size / Dimension: 0.039" L x 0.020" W (1.00mm x 0.50mm); Supplier 1: DigiKey; Supplier Part Number 1: 478-12611-1-ND; Thickness (Max): 0.022" (0.56mm); Voltage - Rated: 25V
CPU? = STM32F405RGT6: CPU
FB?#2 = 1624117-5: FERRITE CHIP 120 OHM 300MA 0805; Manufacturer: TE Connectivity AMP Connectors; Type: Differential Mode - Single; DC Resistance: 300 mOhm Max; Part Number: 1624117-5; PartId: 6827; Value: 120 Ohm @ 100MHz; Supplier 1: Digi-Key; Supplier Part Number 1: A102194TR-ND; ComponentLink1Description: Datasheet; ComponentLink1URL: http://www.te.com/commerce/DocumentDelivery/DDEController?Action=srchrtrv&DocNm=1773178&DocType=DS&DocLang=English; ComponentLink2Description: Digi-Key listing; ComponentLink2URL: http://digikey.com/product-detail/en/1624117-5/A102194TR-ND/2054601; Price: 0.0446; Device Package: 0805 (2012 Metric); Current Rating: 300mA
R?#10 R?#11 = 0603S8J0103: as R?#1 on sheet LCD; Value: 10K; Part Number: 0603S8J0103; Tolerance: 5%; Price: 0.0089; Device Package: 1608 (0603 Metric)
S? = FSM4JSMATR: SWITCH TACTILE SPST-NO 0.05A 24V; Manufacturer: TE Connectivity Alcoswitch Switches; Switch Function: Off-Mom; Contact Rating @ Voltage: 0.05A @ 24VDC; Actuator Type: Standard; Actuator Orientation: Top Actuated; Illumination: Non-Illuminated; Operating Force: 160gf; Switch Travel: 0.25mm; Mechanical Life: 100,000 Cycles; Part Number: FSM4JSMATR; PartId: 8249; Supplier 1: Digi-Key; Supplier Part Number 1: 450-1759-2-ND; ComponentLink1Description: Datasheet; ComponentLink1URL: http://www.te.com/commerce/DocumentDelivery/DDEController?Action=srchrtrv&DocNm=2-1437565-7&DocType=Customer+Drawing&DocLang=English; ComponentLink2Description: Digi-Key Listing; ComponentLink2URL: http://www.digikey.com/product-detail/en/FSM4JSMATR/450-1759-2-ND/529675; Price: 0.128; Circuit: SPST-NO; Illumination Voltage: -; Illumination Type, Colour: -; Operating Temperature: -35C ~ 85C
Y?#1 = ECS-120-20-3X-TR: CRYSTAL 12.0000MHZ 20PF SMD; Manufacturer: ECS Inc.; Frequency Stability: 50ppm; Frequency Tolerance: 30ppm; ESR: 60 Ohm; Operating Mode: Fundamental; Part Number: ECS-120-20-3X-TR; PartId: 8636; Supplier 1: Digi-Key; Supplier Part Number 1: XC1770TR-ND; ComponentLink1Description: Datasheet; ComponentLink1URL: http://www.ecsxtal.com/store/pdf/CSM-3X.pdf; ComponentLink2Description: Digi-Key Listing; ComponentLink2URL: https://www.digikey.com/product-detail/en/ECS-120-20-3X-TR/XC1770TR-ND/2676600; Price: 0.189; Type: MHz Crystal; Device Package: HC49/US; Series: CSM-3X; Frequency: 12MHz; Load Capacitance: 20pF
Y?#2 = ABS25-32.768KHZ-T: CRYSTAL 32.7680KHZ 12.5PF SMD; Manufacturer: Abracon LLC; Frequency Tolerance: 20ppm; ESR: 50 kOhm; Operating Mode: Fundamental; Part Number: ABS25-32.768KHZ-T; PartId: 8457; Supplier 1: Digi-Key; Supplier Part Number 1: 535-9166-2-ND; ComponentLink1Description: Datasheet; ComponentLink1URL: http://www.abracon.com/Resonators/abs25.pdf; ComponentLink2Description: Digi-Key Listing; ComponentLink2URL: http://www.digikey.com/product-detail/en/ABS25-32.768KHZ-T/535-9166-2-ND/675361; Price: 0.18; Type: kHz Crystal (Tuning Fork); Device Package: 4-SOJ, 5.50mm pitch; Frequency: 32.768kHz; Frequency Stability: -; Load Capacitance: 12.5pF

## Sheet Sensors.SchDoc
size A4; SheetNumber: 4; SheetTotal: 4
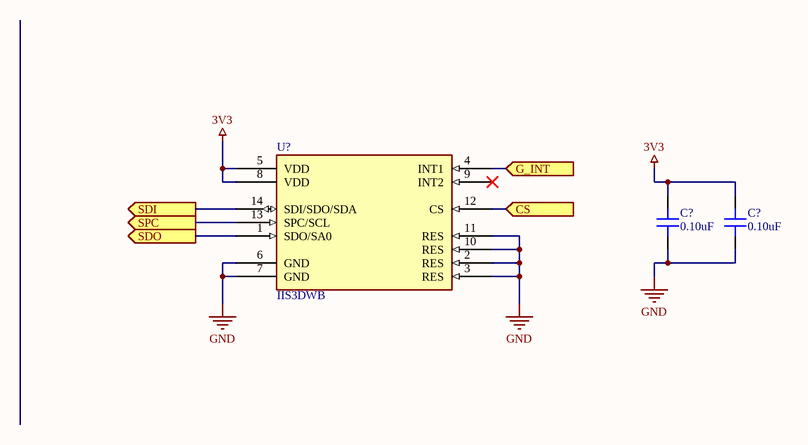
[diagram p3: Sensors.SchDoc]

### Parts
(Parts that share a designator on the sheet are numbered #1, #2 ... from top to bottom, then left to right.)
C?#22  0.10uF  [CAP 0603/1608]
C?#23  0.10uF  [CAP 0603/1608]
U?#3  IIS3DWB  [PQFN50P250X300X86-14N]

### Ports
CS (in), G_INT (in), SDI (out), SDO (out), SPC (out)

### Nets
3V3: C?#22.2 C?#23.2 U?#3.5(VDD) U?#3.8(VDD)
GND: C?#22.1 C?#23.1 U?#3.2(RES) U?#3.3(RES) U?#3.6(GND) U?#3.7(GND) U?#3.10(RES) U?#3.11(RES)
NetU?#3_1: U?#3.1(SDO/SA0) ; port SDO
NetU?#3_4: U?#3.4(INT1) ; port G_INT
NetU?#3_12: U?#3.12(CS) ; port CS
NetU?#3_13: U?#3.13(SPC/SCL) ; port SPC
NetU?#3_14: U?#3.14(SDI/SDO/SDA) ; port SDI

Not connected (* = marked no-connect by the designer): U?#3 9(INT2)*

### Library data of the parts
C?#22 C?#23 = CL10B104KA8NNNC: CAP CER 0.1UF 25V X7R 0603; Manufacturer: Samsung Electro-Mechanics America, Inc.; TemperatureRange: -55C ~ 125C; Tolerance: 10%; Value: 0.10uF; Part Number: CL10B104KA8NNNC; PartId: 13014; Supplier 1: Digi-Key; Supplier Part Number 1: 1276-1006-2-ND; ComponentLink1Description: Datasheet; ComponentLink1URL: http://www.samsungsem.com/kr/support/product-search/mlcc/CL10B104KA8NNNC.jsp; ComponentLink2Description: Digi-Key Listing; ComponentLink2URL: https://www.digikey.com/product-detail/en/samsung-electro-mechanics-america-inc/CL10B104KA8NNNC/1276-1006-2-ND/3886664; TemperatureCoefficient: X7R; Voltage: 25V; Price: 0.0035; Device Package: 0603 (1608 Metric)
U?#3 = IIS3DWB: 3-axis digital vibration sensor

## Nets that join several sheets
3V3: Power (C?#7.2 R?#8.2 U?#2.2 U?#2.4), CPU (14 pins), Sensors (C?#22.2 C?#23.2 U?#3.5 U?#3.8)
5V: LCD (6 pins), Power (5 pins)
GND: LCD (11 pins), Power (14 pins), CPU (15 pins), Sensors (8 pins)